# Altium project 8088.PrjPCB
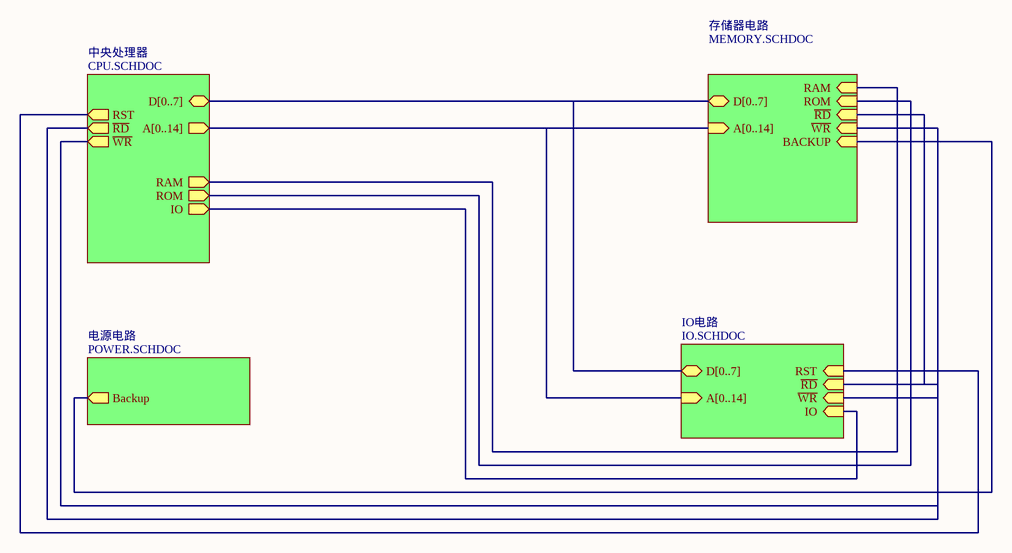
[diagram p0: 顶层8088.SchDoc]
7 sheets, 31 parts. Net scope: hierarchical (ports join the sheet entries above them; power ports are global).
Sheets:
  顶层8088.SchDoc
    中央处理器 = CPU.SchDoc
      译码电路 = DECODER.SchDoc
      脉冲电路 = CLOCK.SchDoc
    存储器电路 = MEMORY.SchDoc
    电源电路 = POWER.SchDoc
    IO电路 = IO.SchDoc

## Sheet 顶层8088.SchDoc
size A4

### Sub-sheets
IO电路 = IO.SCHDOC: D[0..7] (bidir), A[0..14] (in), RST (in), ~{RD} (in), ~{WR} (in), IO (in)
中央处理器 = CPU.SCHDOC: RST (out), ~{RD} (out), ~{WR} (out), D[0..7] (bidir), A[0..14] (out), RAM (out), ROM (out), IO (out)
存储器电路 = MEMORY.SCHDOC: D[0..7] (bidir), A[0..14] (in), RAM (in), ROM (in), ~{RD} (in), ~{WR} (in), BACKUP (in)
电源电路 = POWER.SCHDOC: Backup (out)

### Nets
NetD3_2: sheet 存储器电路/BACKUP, sheet 电源电路/Backup
NetU1_6: sheet 中央处理器/IO, sheet IO电路/IO
NetU1_8: sheet 中央处理器/RST, sheet IO电路/RST
NetU2_20: sheet 中央处理器/RAM, sheet 存储器电路/RAM
NetU2_22: sheet 中央处理器/~{RD}, sheet 中央处理器/~{WR}, sheet 存储器电路/~{RD}, sheet 存储器电路/~{WR}, sheet IO电路/~{RD}, sheet IO电路/~{WR}
NetU3_20: sheet 中央处理器/ROM, sheet 存储器电路/ROM
(unnamed): sheet 中央处理器/D[0..7], sheet 存储器电路/D[0..7], sheet IO电路/D[0..7]
(unnamed): sheet 中央处理器/A[0..14], sheet 存储器电路/A[0..14], sheet IO电路/A[0..14]

## Sheet CPU.SchDoc
size A4
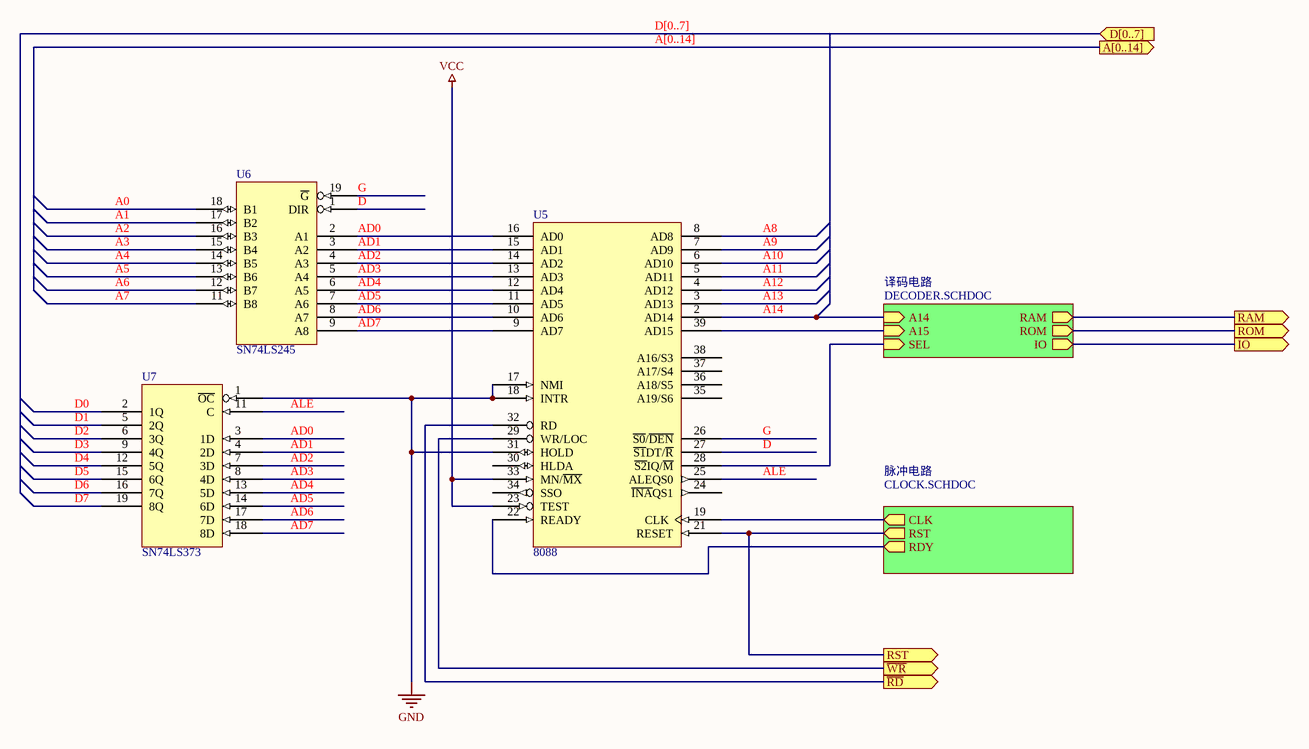
[diagram p1: CPU.SchDoc]

### Parts
U5  8088  [DIP40]
U6  SN74LS245  [SOICW20]
U7  SN74LS373  [DIP20]

### Sub-sheets
脉冲电路 = CLOCK.SCHDOC: CLK (out), RST (out), RDY (out)
译码电路 = DECODER.SCHDOC: A14 (in), A15 (in), SEL (in), RAM (out), ROM (out), IO (out)

### Ports
A[0..14] (out), D[0..7] (in), IO (out), RAM (out), ROM (out), RST (out), ~{RD} (out), ~{WR} (out)

### Nets
GND: U5.1(GND) U5.17(NMI) U5.18(INTR) U5.20(GND) U5.31(HOLD) U6.10(GND) U7.1(~{OC}) U7.10(GND)
VCC: U5.23(TEST) U5.33(MN/~{MX}) U5.40(VCC) U6.20(VCC) U7.20(VCC)
NetU1_6: port IO, sheet 译码电路/IO
NetU1_8: U5.21(RESET) ; port RST, sheet 脉冲电路/RST
NetU2_20: port RAM, sheet 译码电路/RAM
NetU2_22: U5.29(WR/LOC) U5.32(RD) ; port ~{WR}, port ~{RD}
NetU3_20: port ROM, sheet 译码电路/ROM
NetU5_2: U5.2(AD14) ; sheet 译码电路/A14
NetU5_9: U5.9(AD7) U6.9(A8)
NetU5_10: U5.10(AD6) U6.8(A7)
NetU5_11: U5.11(AD5) U6.7(A6)
NetU5_12: U5.12(AD4) U6.6(A5)
NetU5_13: U5.13(AD3) U6.5(A4)
NetU5_14: U5.14(AD2) U6.4(A3)
NetU5_15: U5.15(AD1) U6.3(A2)
NetU5_16: U5.16(AD0) U6.2(A1)
NetU5_19: U5.19(CLK) ; sheet 脉冲电路/CLK
NetU5_22: U5.22(READY) ; sheet 脉冲电路/RDY
NetU5_28: U5.28(~{S2}IQ/~{M}) ; sheet 译码电路/SEL
NetU5_39: U5.39(AD15) ; sheet 译码电路/A15

Not connected (* = marked no-connect by the designer): U5 3(AD13) 4(AD12) 5(AD11) 6(AD10) 7(AD9) 8(AD8) 24(~{INA}QS1) 25(ALEQS0) 26(~{S0}/~{DEN}) 27(~{S1}DT/~{R}) 30(HLDA) 34(SSO) 35(A19/S6) 36(A18/S5) 37(A17/S4) 38(A16/S3); U6 1(DIR) 11(B8) 12(B7) 13(B6) 14(B5) 15(B4) 16(B3) 17(B2) 18(B1) 19(~{G}); U7 2(1Q) 3(1D) 4(2D) 5(2Q) 6(3Q) 7(3D) 8(4D) 9(4Q) 11(C) 12(5Q) 13(5D) 14(6D) 15(6Q) 16(7Q) 17(7D) 18(8D) 19(8Q)

### Notes on the sheet
- D[0..7]
- A[0..14]
- (near U6) G
- A0
- A1
- A2
- A3
- A4
- (near U6) AD0
- (near U6) AD1
- (near U6) AD2
- (near U6) D
- A10
- A9
- A8
- A5
- A6
- A7
- (near U6) AD3
- (near U6) AD4
- (near U6) AD5
- (near U6) AD6
- (near U6) AD7
- A14
- A13
- A12
- A11
- D0
- D1
- D2
- D3
- D4
- ALE
- AD0
- AD1
- AD2
- D
- G
- D5
- D6
- D7
- AD3
- AD4
- AD5
- AD6
- AD7

## Sheet DECODER.SchDoc
size A4
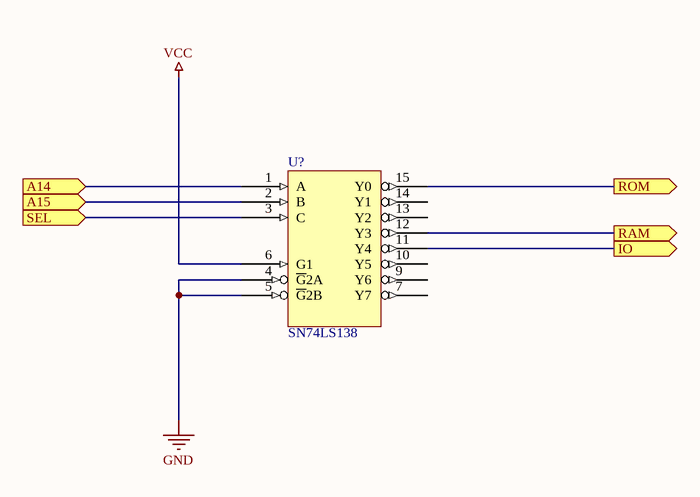
[diagram p2: DECODER.SchDoc]

### Parts
U?  SN74LS138  [SOIC16]

### Ports
A14 (in), A15 (in), IO (out), RAM (out), ROM (out), SEL (in)

### Nets
GND: U?.4(~{G}2A) U?.5(~{G}2B) U?.8(GND)
VCC: U?.6(G1) U?.16(VCC)
NetU1_6: U?.11(Y4) ; port IO
NetU2_20: U?.12(Y3) ; port RAM
NetU3_20: U?.15(Y0) ; port ROM
NetU5_2: U?.1(A) ; port A14
NetU5_28: U?.3(C) ; port SEL
NetU5_39: U?.2(B) ; port A15

Not connected (* = marked no-connect by the designer): U? 7(Y7) 9(Y6) 10(Y5) 13(Y2) 14(Y1)

## Sheet CLOCK.SchDoc
size A4
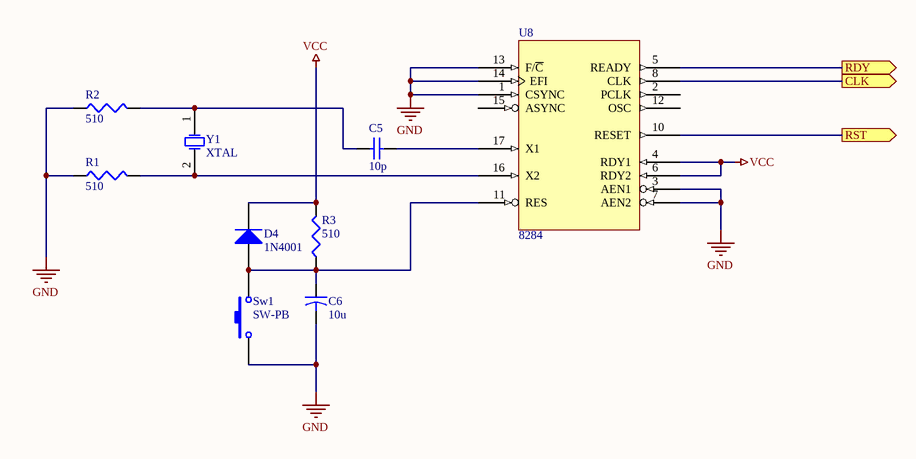
[diagram p3: CLOCK.SchDoc]

### Parts
C5  value 10p  [RAD-0.3]  (hidden comment: Cap)
C6  value 10u  [CAPR5-4X5]  (hidden comment: Cap2)
D4  1N4001  [DO-41]
R1  value 510  [J1-0603]  (hidden comment: Res3)
R2  value 510  [J1-0603]  (hidden comment: Res3)
R3  value 510  [J1-0603]  (hidden comment: Res3)
Sw1  SW-PB  [SPST-2]
U8  8284  [DIP18]
Y1  XTAL  [R38]

### Ports
CLK (out), RDY (out), RST (out)

### Nets
GND: C6.2 R1.1 R2.1 Sw1.1 U8.1(CSYNC) U8.3(AEN1) U8.7(AEN2) U8.9(GND) U8.13(F/~{C}) U8.14(EFI)
VCC: D4.2(K) R3.2 U8.4(RDY1) U8.6(RDY2) U8.18(VCC)
NetC5_1: C5.1 R2.2 Y1.1(OSC1)
NetC5_2: C5.2 U8.17(X1)
NetC6_1: C6.1 D4.1(A) R3.1 Sw1.2 U8.11(RES)
NetR1_2: R1.2 U8.16(X2) Y1.2(OSC2)
NetU1_8: U8.10(RESET) ; port RST
NetU5_19: U8.8(CLK) ; port CLK
NetU5_22: U8.5(READY) ; port RDY

Not connected (* = marked no-connect by the designer): U8 2(PCLK) 12(OSC) 15(ASYNC)

### Library data of the parts
C5 = Cap: Capacitor; Published: 8-Jun-2000; LatestRevisionDate: 17-Jul-2002; LatestRevisionNote: Re-released for DXP Platform.; PackageReference: RAD-0.3; Publisher: Altium Limited
C6 = Cap2: Capacitor; Published: 23-Sep-2002; PackageReference: CAPR5-4X5; Publisher: Altium Limited
D4 = Diode 1N4001: 1 Amp General Purpose Rectifier; Published: 8-Jun-2000; LatestRevisionDate: 17-Jul-2002; LatestRevisionNote: Re-released for DXP Platform.; DatasheetDocument: 1998; PackageDocument: Aug-1999; PackageReference: DO-41; Publisher: Altium Limited; Code_JEDEC: DO-204-AL; ComponentLink1Description: Manufacturer Link; ComponentLink1URL: http://www.fairchildsemi.com/; ComponentLink2Description: Datasheet; ComponentLink2URL: http://www.fairchildsemi.com/ds/1N%2F1N4001.pdf
R1-R3 = Res3: Resistor; Published: 8-Jun-2000; LatestRevisionDate: 04-Mar-2005; LatestRevisionNote: PCB Footprint replaced.; PackageReference: J1-0603; Publisher: Altium Limited
Sw1 = SW-PB: Switch; Published: 24-Mar-1999; LatestRevisionDate: 17-Jul-2002; LatestRevisionNote: Re-released for DXP Platform.; PackageReference: SPST-2; Publisher: Altium Limited
Y1 = XTAL: Crystal Oscillator; Published: 8-Jun-2000; LatestRevisionDate: 17-Jul-2002; LatestRevisionNote: Re-released for DXP Platform.; PackageReference: R38; Publisher: Altium Limited

## Sheet MEMORY.SchDoc
size A4
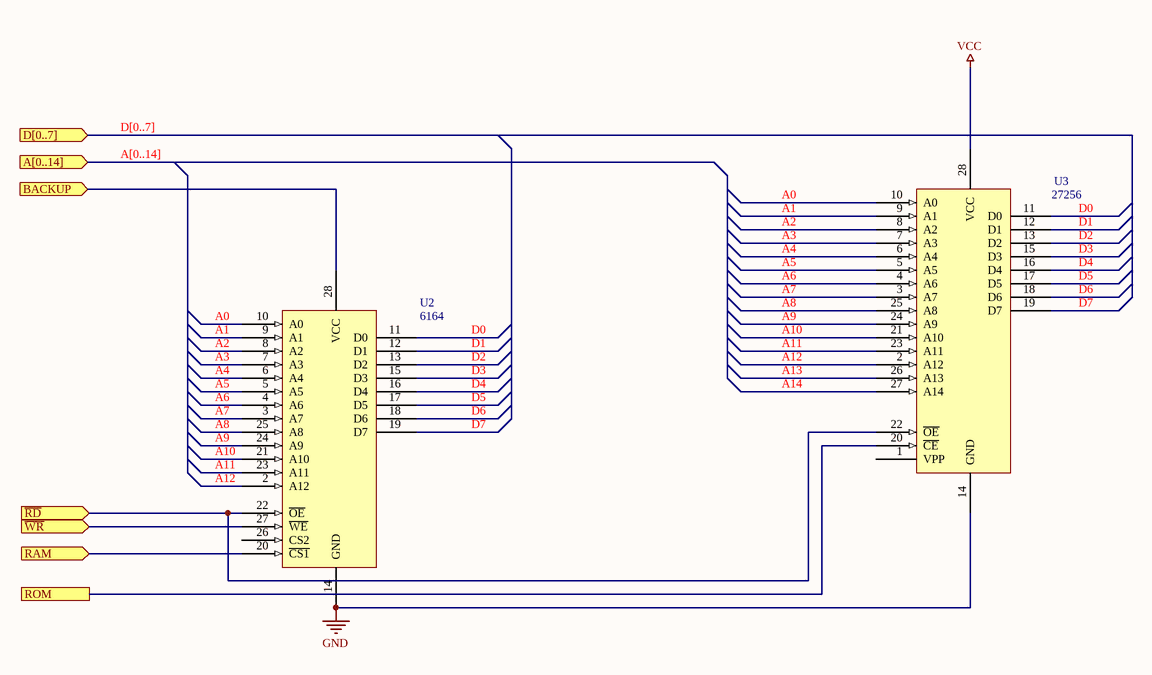
[diagram p4: MEMORY.SchDoc]

### Parts
U2  6164  [DIP28]
U3  27256  [DIP28]

### Ports
A[0..14] (in), BACKUP (in), D[0..7] (in), RAM (in), ROM, ~{RD} (in), ~{WR} (in)

### Nets
GND: U2.14(GND) U3.14(GND)
VCC: U3.28(VCC)
NetD3_2: U2.28(VCC) ; port BACKUP
NetU2_20: U2.20(~{CS1}) ; port RAM
NetU2_22: U2.22(~{OE}) U2.27(~{WE}) U3.22(~{OE}) ; port ~{RD}, port ~{WR}
NetU3_20: U3.20(~{CE}) ; port ROM

Not connected (* = marked no-connect by the designer): U2 2(A12) 3(A7) 4(A6) 5(A5) 6(A4) 7(A3) 8(A2) 9(A1) 10(A0) 11(D0) 12(D1) 13(D2) 15(D3) 16(D4) 17(D5) 18(D6) 19(D7) 21(A10) 23(A11) 24(A9) 25(A8) 26(CS2); U3 1(VPP) 2(A12) 3(A7) 4(A6) 5(A5) 6(A4) 7(A3) 8(A2) 9(A1) 10(A0) 11(D0) 12(D1) 13(D2) 15(D3) 16(D4) 17(D5) 18(D6) 19(D7) 21(A10) 23(A11) 24(A9) 25(A8) 26(A13) 27(A14)

### Notes on the sheet
- D[0..7]
- A[0..14]
- A0
- A1
- A2
- D0
- D1
- A3
- A4
- A5
- A6
- A7
- D2
- D3
- D4
- D5
- D6
- A8
- A9
- A10
- A11
- A12
- D7
- A13
- A14
- (near U2) A10
- (near U2) A11
- (near U2) A12

## Sheet POWER.SchDoc
size A4
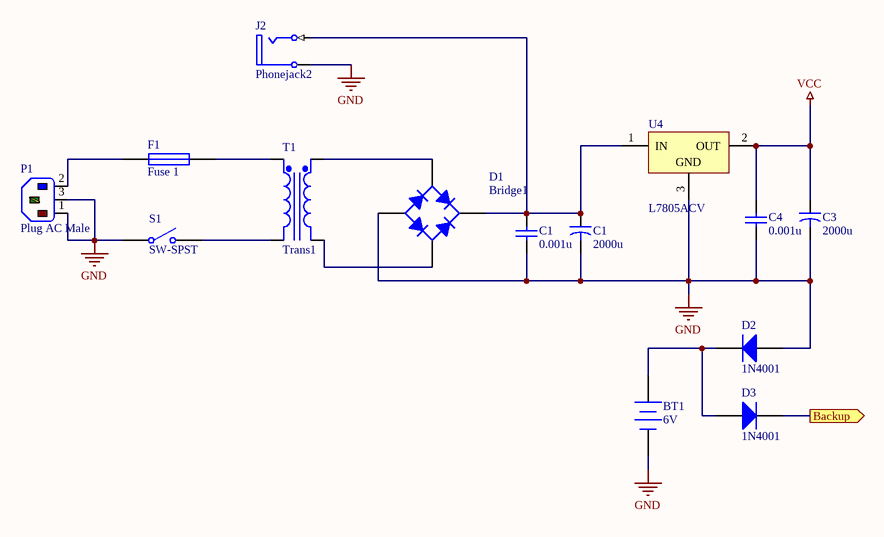
[diagram p5: POWER.SchDoc]

### Parts
(Parts that share a designator on the sheet are numbered #1, #2 ... from top to bottom, then left to right.)
BT1  6V  [BAT-2]
C1#1  value 2000u  [CAPR5-4X5]  (hidden comment: Cap2)
C1#2  value 0.001u  [RAD-0.3]  (hidden comment: Cap)
C3  value 2000u  [CAPR5-4X5]  (hidden comment: Cap2)
C4  value 0.001u  [RAD-0.3]  (hidden comment: Cap)
D1  Bridge1  [D-38]
D2  1N4001  [DO-41]
D3  1N4001  [DO-41]
F1  Fuse 1  [PIN-W2/E2.8]
J2  Phonejack2  [JACK/6-V2]
P1  Plug AC Male  [IEC9.14-2H3]
S1  SW-SPST  [SPST-2]
T1  Trans1  [TRF_4]
U4  L7805ACV  [TO220ABN]

### Ports
Backup (out)

### Nets
GND: BT1.2(-) C1#1.2 C1#2.1 C3.2 C4.2 D1.1(A) D2.1(A) J2.5(S) P1.1(L) P1.3(E) S1.1(COMMON) U4.3(GND)
VCC: C3.1 C4.1 U4.2(OUT)
NetBT1_1: BT1.1(+) D2.2(K) D3.1(A)
NetC1#1_1: C1#1.1 C1#2.2 D1.3(K) J2.1(T) U4.1(IN)
NetD1_2: D1.2(C) T1.3(Sec+)
NetD1_4: D1.4(C) T1.4(Sec-)
NetD3_2: D3.2(K) ; port Backup
NetF1_1: F1.1 P1.2(N)
NetF1_2: F1.2 T1.1(Pri+)
NetS1_2: S1.2(NO) T1.2(Pri-)

### Library data of the parts
BT1 = Battery: Multicell Battery; Published: 24-Mar-1999; LatestRevisionDate: 17-Jul-2002; LatestRevisionNote: Re-released for DXP Platform.; PackageReference: BAT-2; Publisher: Altium Limited
C1#1 C3 = Cap2: Capacitor; Published: 23-Sep-2002; PackageReference: CAPR5-4X5; Publisher: Altium Limited
C1#2 C4 = Cap: Capacitor; Published: 8-Jun-2000; LatestRevisionDate: 17-Jul-2002; LatestRevisionNote: Re-released for DXP Platform.; PackageReference: RAD-0.3; Publisher: Altium Limited
D1 = Bridge1: Full Wave Diode Bridge; Published: 8-Jun-2000; LatestRevisionDate: 17-Jul-2002; LatestRevisionNote: Re-released for DXP Platform.; PackageReference: D-38; Publisher: Altium Limited
D2 D3 = Diode 1N4001: 1 Amp General Purpose Rectifier; Published: 8-Jun-2000; LatestRevisionDate: 17-Jul-2002; LatestRevisionNote: Re-released for DXP Platform.; DatasheetDocument: 1998; PackageDocument: Aug-1999; PackageReference: DO-41; Publisher: Altium Limited; Code_JEDEC: DO-204-AL; ComponentLink1Description: Manufacturer Link; ComponentLink1URL: http://www.fairchildsemi.com/; ComponentLink2Description: Datasheet; ComponentLink2URL: http://www.fairchildsemi.com/ds/1N%2F1N4001.pdf
F1 = Fuse 1: Fuse; Published: 8-Jun-2000; LatestRevisionDate: 17-Jul-2002; LatestRevisionNote: Re-released for DXP Platform.; PackageReference: PIN-W2/E2.8; Publisher: Altium Limited
J2 = Phonejack2: Jack Socket, 1/4" [6.5mm], Thru-Hole, Vertical, 2-Conductor Open Circuit; PackageDocument: 2003; PCB_Layout: Complies with manufacturer's recommendation.; DrillAndSlotSize: Corresponds to nominal value.; LatestRevisionDate: 15-Jul-2004; LatestRevisionNote: Component Replaced.; DatasheetDocument: 2003; PackageReference: S1VS_SNS; Publisher: Altium Limited; ComponentLink1Description: Manufacturer Link; ComponentLink1URL: http://www.cliffuk.co.uk/
P1 = Plug AC Male: IEC Mains Power Inlet, EN60 320-1 C14 Class I Cold Condition, PC Flange Rear Mount, Chassis Plug; PackageDocument: ver.80, 15-Sep-2003; MaximumRating: 10A, 250V a.c. (UL & CSA 15A, 250V a.c.); MountingFixtures: Not drawn on schematic symbol.; PCB_Layout: Complies with manufacturer's recommendation.; DrillSize: Corresponds to nominal value.; Note: IEC Color Scheme employed for L, N and E.; Published: 15-Jul-2004; LatestRevisionDate: 15-Jul-2004; LatestRevisionNote: Component Replaced.; DatasheetDocument: ver.80, 15-Sep-2003; PackageReference: PX0580/PC; Publisher: Altium Limited; Terminations: P.C. Spills; ComponentLink1Description: Manufacturer Link; ComponentLink1URL: http://www.bulgin.co.uk/
S1 = SW-SPST: Single-Pole, Single-Throw Switch; Published: 24-Mar-1999; LatestRevisionDate: 17-Jul-2002; LatestRevisionNote: Re-released for DXP Platform.; PackageReference: SPST-2; Publisher: Altium Limited
T1 = Trans Ideal: Transformer (Ideal); Published: 8-Jun-2000; LatestRevisionDate: 17-Jul-2002; LatestRevisionNote: Re-released for DXP Platform.; PackageReference: TRF_4; Publisher: Altium Limited
U4 = L7805ACV: Precision 1A Regulator; Note: Tab is connected to pin 3 (GND).; Published: 24-Aug-2001; LatestRevisionDate: 17-Jul-2002; LatestRevisionNote: Re-released for DXP Platform.; DatasheetVersion: Nov-1999; PackageVersion: Jun-1998; PackageReference: TO220ABN; Publisher: Altium Limited; PackageDescription: TO, Thru-Hole, Vertical, Heatsink Mounted; 3 In-Line Leads; Pitch 2.54 mm; Pin sequence 1, 3, 2; ComponentLink1Description: Manufacturer Link; ComponentLink1URL: http://www.st.com/; ComponentLink2Description: Datasheet; ComponentLink2URL: http://www.st.com/stonline/products/literature/ds/2144/l7805ab.pdf

## Sheet IO.SchDoc
size A4
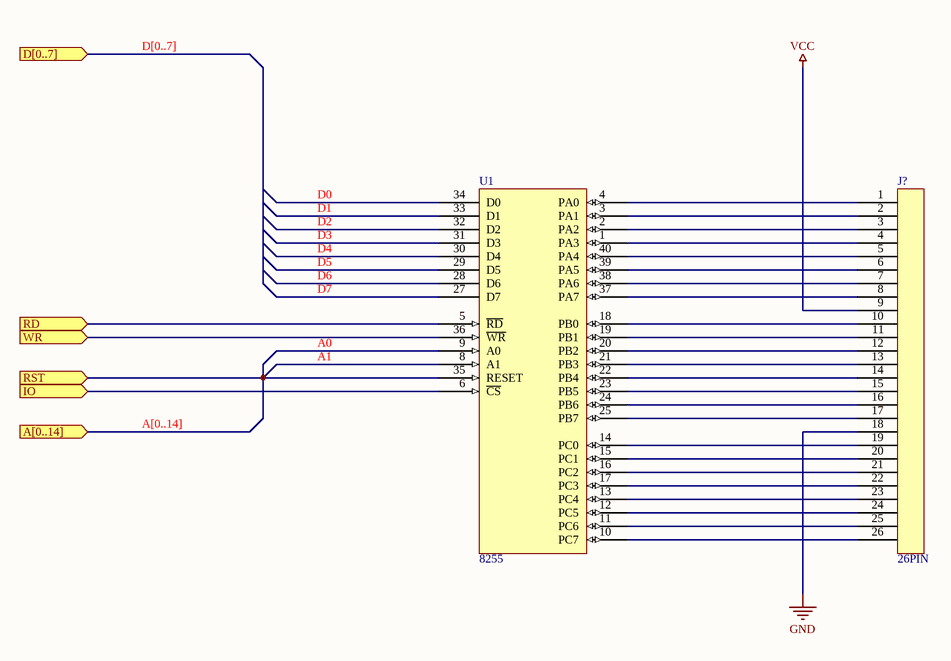
[diagram p6: IO.SchDoc]

### Parts
J?  26PIN  [IDC26]
U1  8255  [DIP40]

### Ports
A[0..14] (in), D[0..7] (in), IO (in), RD (in), RST (in), WR (in)

### Nets
GND: J?.18 U1.7(GND)
VCC: J?.9 U1.26(VCC)
NetJ?_1: J?.1 U1.4(PA0)
NetJ?_2: J?.2 U1.3(PA1)
NetJ?_3: J?.3 U1.2(PA2)
NetJ?_4: J?.4 U1.1(PA3)
NetJ?_5: J?.5 U1.40(PA4)
NetJ?_6: J?.6 U1.39(PA5)
NetJ?_7: J?.7 U1.38(PA6)
NetJ?_8: J?.8 U1.37(PA7)
NetJ?_10: J?.10 U1.18(PB0)
NetJ?_11: J?.11 U1.19(PB1)
NetJ?_12: J?.12 U1.20(PB2)
NetJ?_13: J?.13 U1.21(PB3)
NetJ?_14: J?.14 U1.22(PB4)
NetJ?_15: J?.15 U1.23(PB5)
NetJ?_16: J?.16 U1.24(PB6)
NetJ?_17: J?.17 U1.25(PB7)
NetJ?_19: J?.19 U1.14(PC0)
NetJ?_20: J?.20 U1.15(PC1)
NetJ?_21: J?.21 U1.16(PC2)
NetJ?_22: J?.22 U1.17(PC3)
NetJ?_23: J?.23 U1.13(PC4)
NetJ?_24: J?.24 U1.12(PC5)
NetJ?_25: J?.25 U1.11(PC6)
NetJ?_26: J?.26 U1.10(PC7)
NetU1_5: U1.5(~{RD}) ; port RD
NetU1_6: U1.6(~{CS}) ; port IO
NetU1_8: U1.8(A1) U1.35(RESET) ; port RST
NetU1_36: U1.36(~{WR}) ; port WR

Not connected (* = marked no-connect by the designer): U1 9(A0) 27(D7) 28(D6) 29(D5) 30(D4) 31(D3) 32(D2) 33(D1) 34(D0)

### Notes on the sheet
- D[0..7]
- D0
- D1
- D2
- D3
- D4
- D5
- D6
- D7
- A0
- A1
- A[0..14]

## Nets that join several sheets
GND: CPU (8 pins), DECODER (U?.4 U?.5 U?.8), CLOCK (10 pins), MEMORY (U2.14 U3.14), POWER (12 pins), IO (J?.18 U1.7)
VCC: CPU (5 pins), DECODER (U?.6 U?.16), CLOCK (5 pins), MEMORY (U3.28), POWER (C3.1 C4.1 U4.2), IO (J?.9 U1.26)
NetD3_2: MEMORY (U2.28), POWER (D3.2)
NetU1_6: DECODER (U?.11), IO (U1.6)
NetU1_8: CPU (U5.21), CLOCK (U8.10), IO (U1.8 U1.35)
NetU2_20: DECODER (U?.12), MEMORY (U2.20)
NetU2_22: CPU (U5.29 U5.32), MEMORY (U2.22 U2.27 U3.22)
NetU3_20: DECODER (U?.15), MEMORY (U3.20)
NetU5_2: CPU (U5.2), DECODER (U?.1)
NetU5_19: CPU (U5.19), CLOCK (U8.8)
NetU5_22: CPU (U5.22), CLOCK (U8.5)
NetU5_28: CPU (U5.28), DECODER (U?.3)
NetU5_39: CPU (U5.39), DECODER (U?.2)